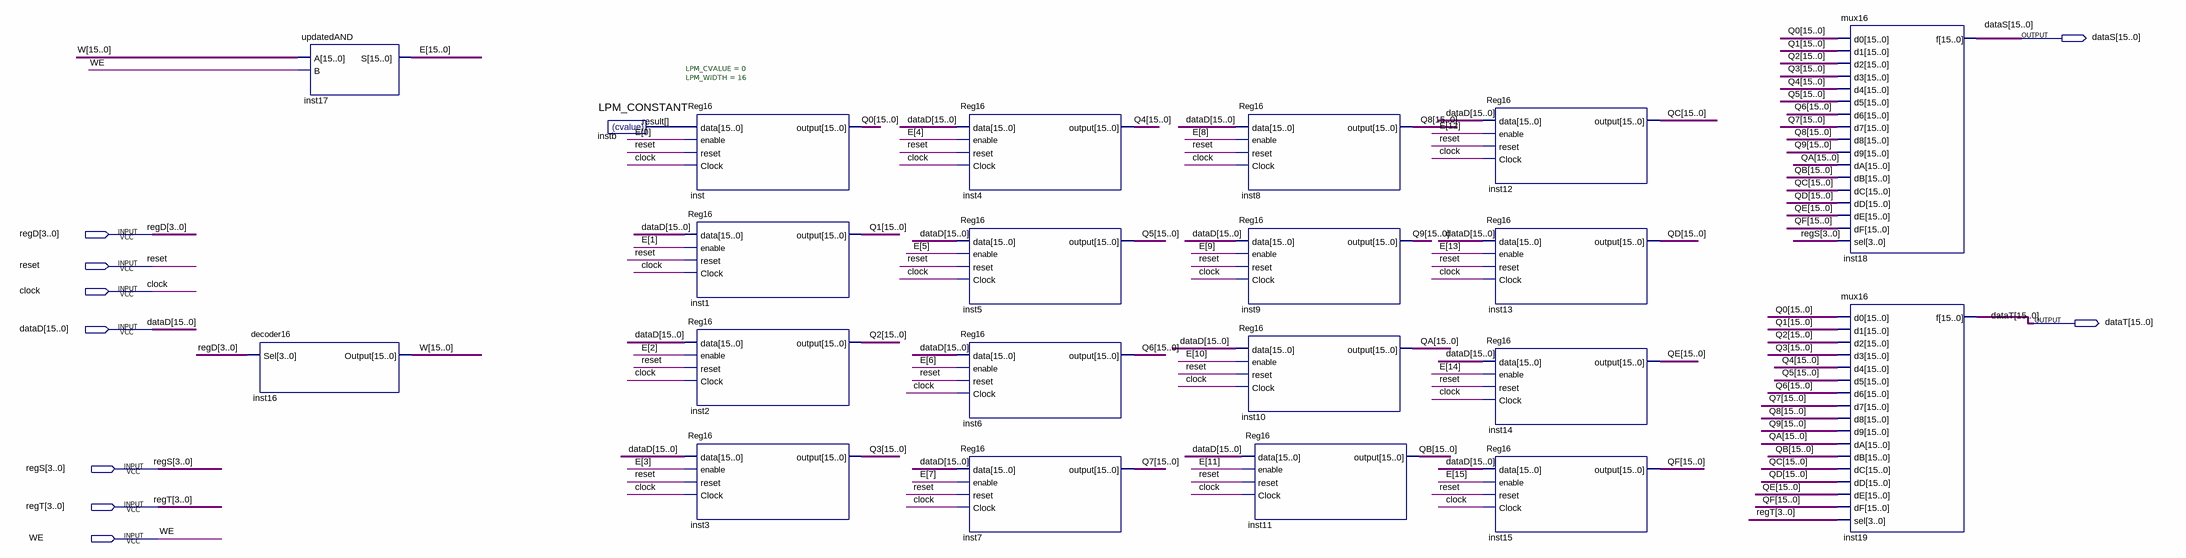
[diagram p0: schematic sheet]
// Quartus schematic SixteenRegisterFile.bdf as structural Verilog: 21 symbols, 9 pins
module SixteenRegisterFile (
  input  [3:0] regD,
  input  reset,
  input  clock,
  input  [15:0] dataD,
  input  [3:0] regS,
  input  [3:0] regT,
  input  WE,
  output [15:0] dataS,
  output [15:0] dataT
);

  wire [15:0] E, instb_result, Q0, Q1, Q2, Q3, Q4, Q5, Q6, Q7, Q8, Q9, QA, QB, QC, QD, QE, QF, W;

  decoder16 inst16 (.Sel(regD), .Output(W));
  updatedAND inst17 (.A(W), .B(WE), .S(E));
  LPM_CONSTANT #(.LPM_CVALUE(0), .LPM_WIDTH(16)) instb (.result(instb_result));
  Reg16 inst (.data(instb_result), .enable(E[0]), .reset(reset), .Clock(clock), .\output (Q0));
  Reg16 inst1 (.data(dataD), .enable(E[1]), .reset(reset), .Clock(clock), .\output (Q1));
  Reg16 inst2 (.data(dataD), .enable(E[2]), .reset(reset), .Clock(clock), .\output (Q2));
  Reg16 inst3 (.data(dataD), .enable(E[3]), .reset(reset), .Clock(clock), .\output (Q3));
  Reg16 inst4 (.data(dataD), .enable(E[4]), .reset(reset), .Clock(clock), .\output (Q4));
  Reg16 inst5 (.data(dataD), .enable(E[5]), .reset(reset), .Clock(clock), .\output (Q5));
  Reg16 inst6 (.data(dataD), .enable(E[6]), .reset(reset), .Clock(clock), .\output (Q6));
  Reg16 inst7 (.data(dataD), .enable(E[7]), .reset(reset), .Clock(clock), .\output (Q7));
  Reg16 inst8 (.data(dataD), .enable(E[8]), .reset(reset), .Clock(clock), .\output (Q8));
  Reg16 inst9 (.data(dataD), .enable(E[9]), .reset(reset), .Clock(clock), .\output (Q9));
  Reg16 inst10 (.data(dataD), .enable(E[10]), .reset(reset), .Clock(clock), .\output (QA));
  Reg16 inst11 (.data(dataD), .enable(E[11]), .reset(reset), .Clock(clock), .\output (QB));
  Reg16 inst12 (.data(dataD), .enable(E[12]), .reset(reset), .Clock(clock), .\output (QC));
  Reg16 inst13 (.data(dataD), .enable(E[13]), .reset(reset), .Clock(clock), .\output (QD));
  Reg16 inst14 (.data(dataD), .enable(E[14]), .reset(reset), .Clock(clock), .\output (QE));
  Reg16 inst15 (.data(dataD), .enable(E[15]), .reset(reset), .Clock(clock), .\output (QF));
  mux16 inst18 (
    .d0(Q0), .d1(Q1), .d2(Q2), .d3(Q3), .d4(Q4), .d5(Q5), .d6(Q6), .d7(Q7), .d8(Q8), .d9(Q9), .dA(QA),
    .dB(QB), .dC(QC), .dD(QD), .dE(QE), .dF(QF), .sel(regS), .f(dataS));
  mux16 inst19 (
    .d0(Q0), .d1(Q1), .d2(Q2), .d3(Q3), .d4(Q4), .d5(Q5), .d6(Q6), .d7(Q7), .d8(Q8), .d9(Q9), .dA(QA),
    .dB(QB), .dC(QC), .dD(QD), .dE(QE), .dF(QF), .sel(regT), .f(dataT));
endmodule
